# EAGLE design CAN-Simulator_v2 (EAGLE 7.5.0)
DATABASE: /home/monkbroc/Electronics/eagle/PARTSDB.tsv
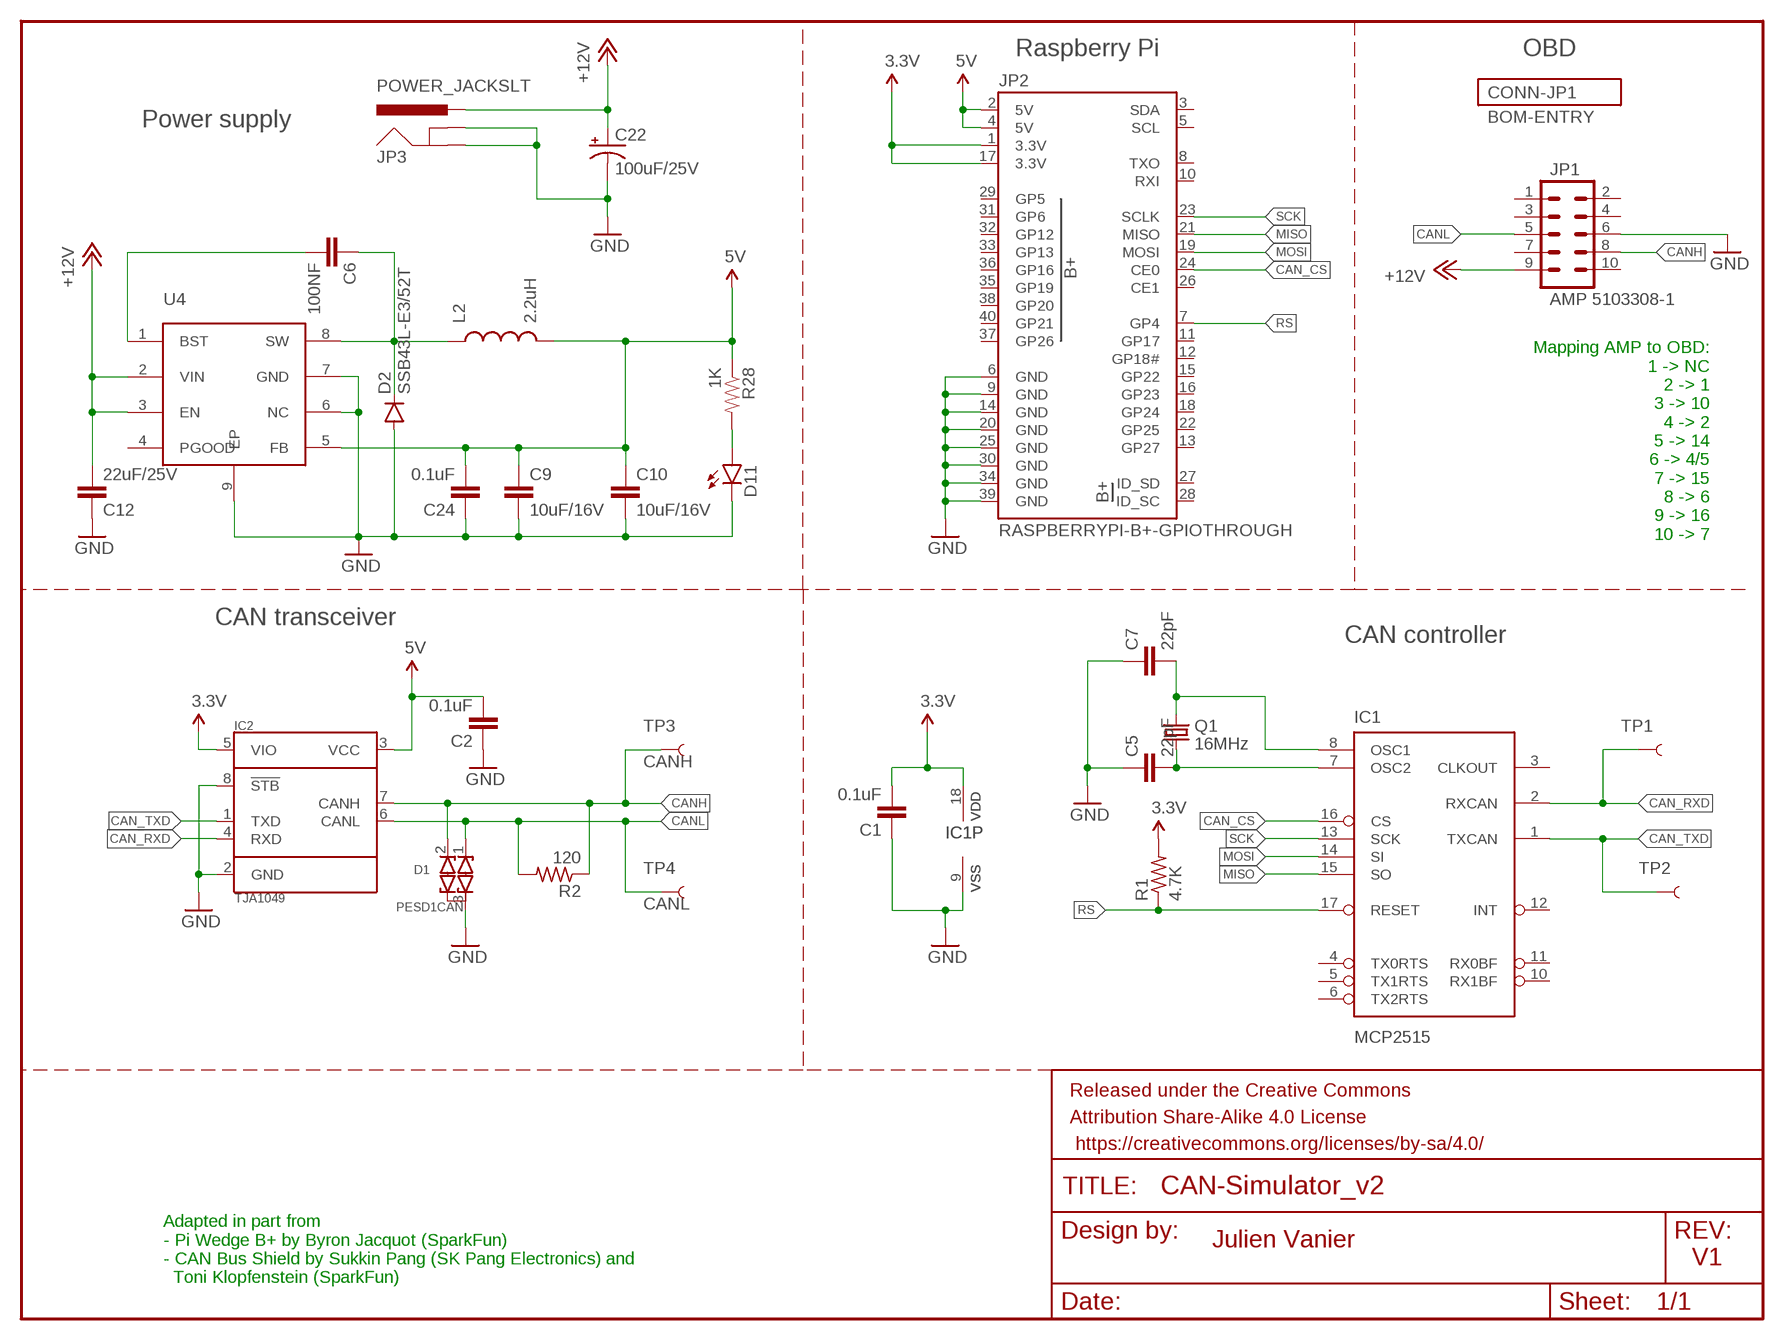
[diagram p0: schematic, sheet 1]
CONN-JP1 (BOM-ENTRY): PARTNO: 1658621-1

## Parts
C1  0.1uF  CAP0402-CAP  [0402-CAP]
C2  0.1uF  CAP0402-CAP  [0402-CAP]
C5  22pF  C-EUC0805  [C0805]
C6  100NF  CAP0402-CAP  [0402-CAP]
C7  22pF  C-EUC0805  [C0805]
C9  10uF/16V  10UF10V10%(0805)  [0805-CAP]
C10  10uF/16V  10UF10V10%(0805)  [0805-CAP]
C12  22uF/25V  22UF-16V-20%-(1210)  [1210]
C22  100uF/25V  100UF-25V-20%(PTH)  [CPOL-RADIAL-100UF-25V]
C24  0.1uF  CAP0402-CAP  [0402-CAP]
D1  PESD1CAN  DIODE_ESD_DUAL-SOT-23  [SOT23]
D2  SSB43L-E3/52T  DIODESMB  [SMB-DIODE]
D11  LED0603  [LED-0603]
FRAME1  FRAME-LETTER  [CREATIVE_COMMONS]
IC1  MCP2515  MCP2510SO  [SO-18W]
IC2  TJA1049  [SO8]
JP1  AMP 5103308-1  M05X2SHD  [2X5-SHROUDED]
JP2  RASPBERRYPI-B+-GPIOTHROUGH  [PIN_20X2]
JP3  POWER_JACKSLT  [POWER_JACK_SLOT]
L2  2.2uH  INDUCTOR4818  [I4818]
Q1  16MHz  CRYSTAL5X3  [CRYSTAL-SMD-5X3]
R1  4.7K  R-US_R0402  [R0402]
R2  120  R-US_R0603  [R0603]
R28  1K  RESISTOR0402-RES  [0402-RES]
TP1  TEST-POINT3X5  [PAD.03X.05]
TP2  TEST-POINT3X5  [PAD.03X.05]
TP3  CANH  TEST-POINT3  [PAD.03X.03]
TP4  CANL  TEST-POINT3  [PAD.03X.03]
U4  ADP2303  [ADP2302]

## Nets
3.3V: C1.2 IC1.18(VDD) IC2.5(VIO) JP2.1(3.3V) JP2.17(3.3V) R1.2
5V [power]: C2.2 C9.1 C10.1 C24.2 IC2.3(VCC) JP2.2(5V) JP2.4(5V) L2.2 R28.1 U4.5(FB)
+12V [power]: C12.2 C22.1(+) JP1.9 JP3.PWR U4.2(VIN) U4.3(EN)
CAN_CS: IC1.16(CS) JP2.24(CE0)
CAN_RXD: IC1.2(RXCAN) IC2.4(RXD) TP1.P$1
CAN_TXD: IC1.1(TXCAN) IC2.1(TXD) TP2.P$1
CANH: D1.2(C2) IC2.7(CANH) JP1.8 R2.1 TP3.P$1
CANL: D1.1(C1) IC2.6(CANL) JP1.5 R2.2 TP4.P$1
GND [power]: C1.1 C2.1 C5.1 C7.1 C9.2 C10.2 C12.1 C22.2(-) C24.1 D1.3(COM) D2.A D11.C IC1.9(VSS) IC2.2(GND) IC2.8(!STB) JP1.6 JP2.6(GND) JP2.9(GND) JP2.14(GND) JP2.20(GND) JP2.25(GND) JP2.30(GND) JP2.34(GND) JP2.39(GND) JP3.GND@1(GNDBREAK) JP3.GND@2(GND) U4.6(NC) U4.7(GND) U4.9(EP)
MISO: IC1.15(SO) JP2.21(MISO)
MOSI: IC1.14(SI) JP2.19(MOSI)
N$17: C7.2 IC1.8(OSC1) Q1.3
N$18: C5.2 IC1.7(OSC2) Q1.1
N$21: C6.2 U4.1(BST)
N$25: C6.1 D2.C L2.1 U4.8(SW)
N$46: D11.A R28.2
RS: IC1.17(RESET) JP2.7(GP4) R1.1
SCK: IC1.13(SCK) JP2.23(SCLK)
Unconnected: IC1.3(CLKOUT) IC1.4(TX0RTS) IC1.5(TX1RTS) IC1.6(TX2RTS) IC1.10(RX1BF) IC1.11(RX0BF) IC1.12(INT) JP1.1 JP1.2 JP1.3 JP1.4 JP1.7 JP1.10 JP2.3(SDA) JP2.5(SCL) JP2.8(TXO) JP2.10(RXI) JP2.11(GP17) JP2.12(GP18#) JP2.13(GP27) JP2.15(GP22) JP2.16(GP23) JP2.18(GP24) JP2.22(GP25) JP2.26(CE1) JP2.27(ID_SD) JP2.28(ID_SC) JP2.29(GP5) JP2.31(GP6) JP2.32(GP12) JP2.33(GP13) JP2.35(GP19) JP2.36(GP16) JP2.37(GP26) JP2.38(GP20) JP2.40(GP21) U4.4(PGOOD)

## Notes on the sheet
- Raspberry Pi | OBD
- Power supply
- Mapping AMP to OBD:
  1 -> NC
  2 -> 1
  3 -> 10
  4 -> 2
  5 -> 14
  6 -> 4/5
  7 -> 15
  8 -> 6
  9 -> 16
  10 -> 7
- CAN transceiver
- CAN controller
- Julien Vanier
- V1
- Adapted in part from
  - Pi Wedge B+ by Byron Jacquot (SparkFun)
  - CAN Bus Shield by Sukkin Pang (SK Pang Electronics) and
    Toni Klopfenstein (SparkFun)

## Library data of the parts
C1 C2 C6 C24 = SparkFun-Passives:CAP: Capacitor Standard 0603 ceramic capacitor, and 0.1" leaded capacitor.
C5 C7 = rcl:C-EU: CAPACITOR, European symbol; PARTNO: C0805C220J5GACTU
C9 C10 = SparkFun-Capacitors:10UF10V10%(0805): CAP-11330; PROD_ID: CAP-11330
C12 = SparkFun-Capacitors:22UF-16V-20%-(1210): CAP-10381; PROD_ID: CAP-10381; VALUE: 22uF
C22 = SparkFun-Capacitors:100UF-25V-20%(PTH): CAP-08439; PROD_ID: CAP-08439
D1 = MuniRent:DIODE_ESD_DUAL: Dual ESD Diode, with a common anode; PARTNO: PESD1CAN-215
D2 = SparkFun-DiscreteSemi:DIODE: Diode These are standard reverse protection diodes and small signal diodes. SMA package can handle up to about 1A. SOD-323 can handle about 200mA. What the SOD-323 package when ordering, there are some mfgs out there that are 5-pin packages.; PROD_ID: DIO-09646
D11 = SparkFun-LED:LED: LEDs Standard schematic elements and footprints for 5mm, 3mm, 1206, and 0603 sized LEDs. 5mm - Spark Fun Electronics SKU : COM-00529 (and others)
FRAME1 = SparkFun-Aesthetics:FRAME-LETTER: Schematic Frame Standard 8.5x11 US Letter frame; BOM: EXCLUDE
IC1 = SparkFun-DigitalIC:MCP2510: CAN controller with SPI interface to any MCU. Original design by Microchip.; PARTNO: MCP2515-I/SO; PROD_ID: IC-09906
IC2 = MuniRent:TJA1049; PARTNO: TJA1049T-118
JP1 = SparkFun-Connectors:M05X2: Header 5x2 Standard 10-pin dual row 0.1" header. Commonly used with AVR-ISP. Use with Spark Fun Electronics SKU: PRT-00778; PARTNO: 5103308-1
JP2 = MuniRent:RASPBERRYPI-B+-GPIO: Raspberry Pi B+ GPIO Header 2x20 pin connector
JP3 = MuniRent:POWER_JACK: Power Jack This is the standard 5.5mm barrel jack for power. The PTH is the most common, proven, reliable, footprint. The Slot footprint only works if the mill layer is transmitted to the PCB fab house so be warned. Spark Fun Electronics SKU : PRT-00119 SMT: CONN-08106 Mating wall wart : TOL-00298 (and others)
L2 = MuniRent:INDUCTOR: Inductors Basic Inductor/Choke - 0603 and 1206. Footprints are not proven and vary greatly between part numbers.
Q1 = SparkFun-FreqCtrl:CRYSTAL: Various standard crystals. Proven footprints.; PARTNO: ABM3B-16.000MHZ-10-1-U-T; PROD_ID: XTAL-08218
R1 = rcl:R-US_: RESISTOR, American symbol; PARTNO: RC0805JR-0747KL
R2 = rcl:R-US_: RESISTOR, American symbol; PARTNO: RC0603FR-07120RL
R28 = SparkFun-Passives:RESISTOR: Resistor Basic schematic elements and footprints for 0603, 1206, and PTH resistors.
TP1-TP4 = SparkFun-Passives:TEST-POINT: Bare copper test points for troubleshooting or ICT; BOM: EXCLUDE
U4 = MuniRent:ADP2303

## Net classes
1 power: width 0.813 mm, clearance 0.406 mm

## Board
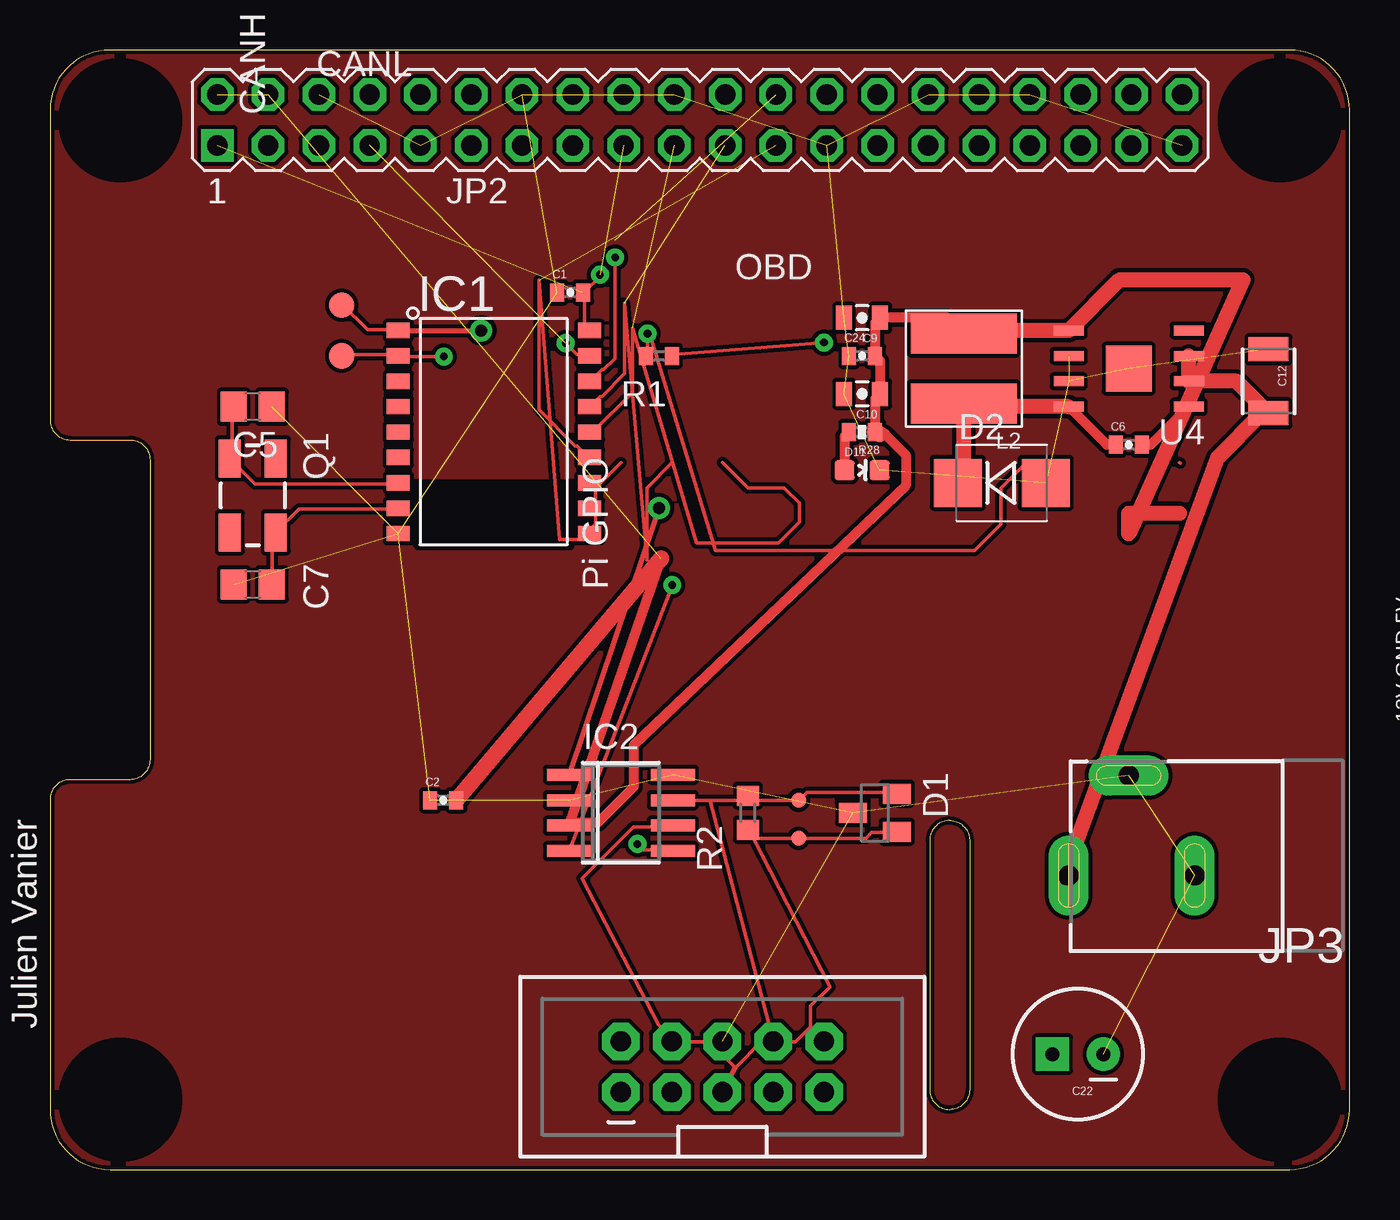
[diagram p1: board, top side]
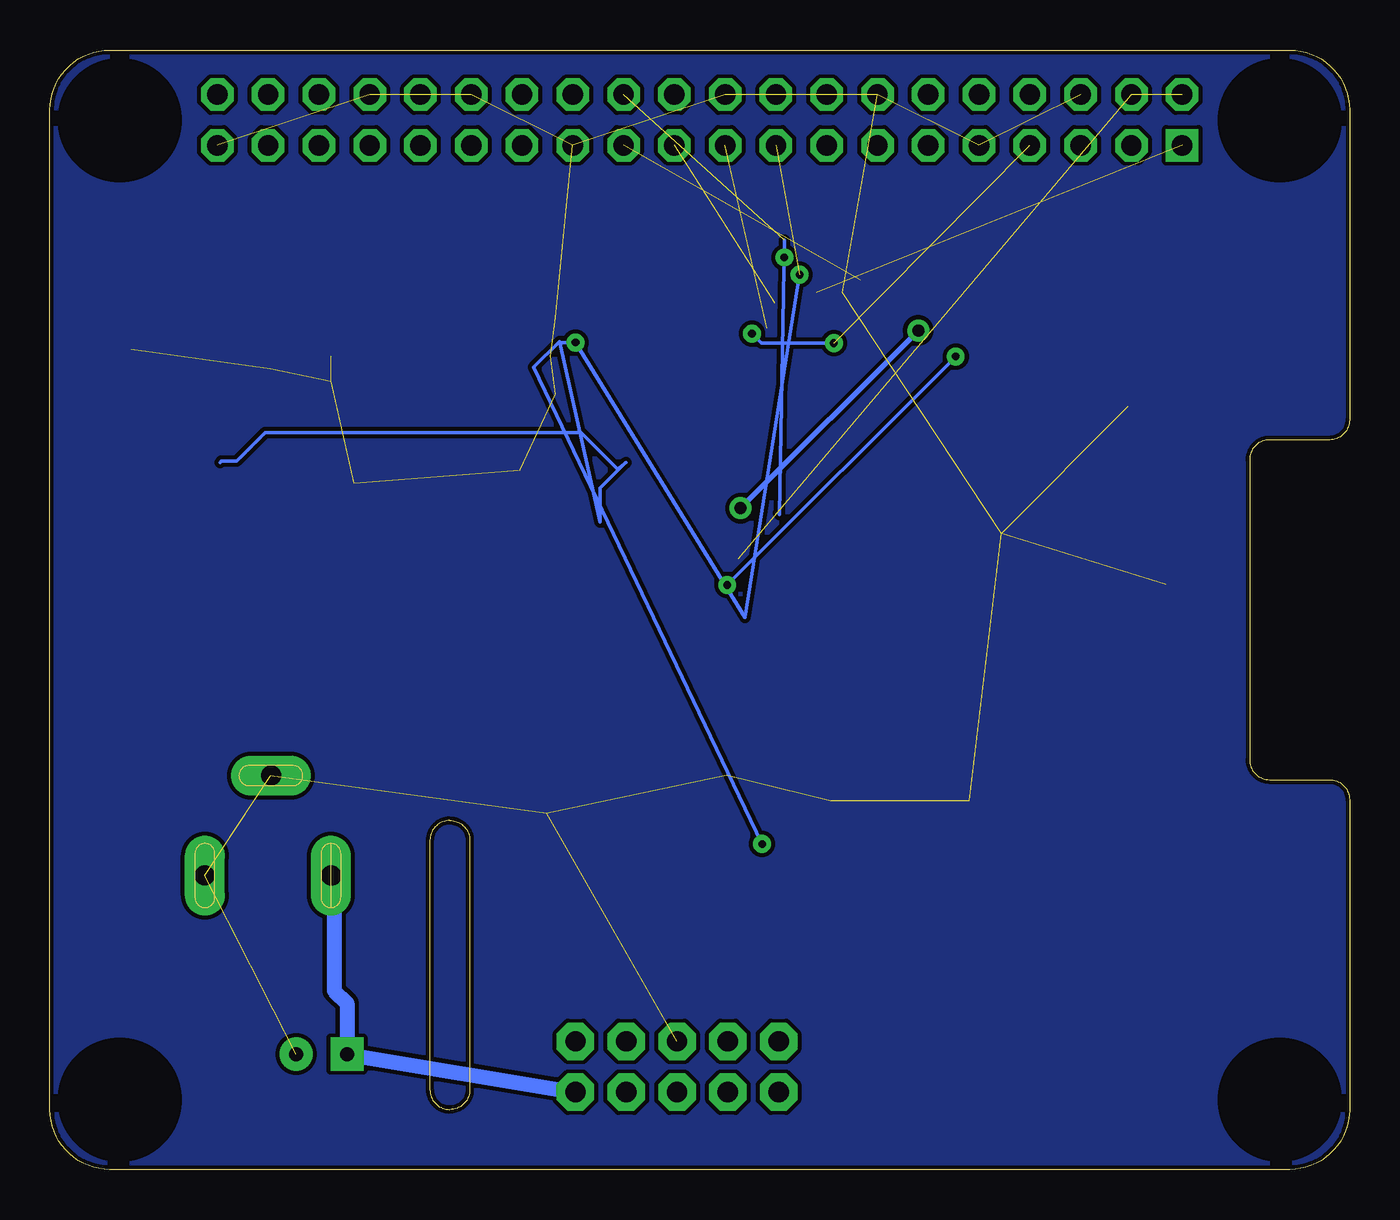
[diagram p2: board, bottom side, seen from below]

Size 65 x 56 mm. Coordinates in mm from the lower left corner, seen from the top.
Outline: 0,3 arc90 3,0 62,0 arc90 65,3 65,53 arc90 62,56 3,56 arc90 0,53 0,37.5 arc90 1,36.5 4,36.5 arc-90 5,35.5 5,20.5 arc-90 4,19.5 1,19.5 arc90 0,18.5 0,3
Outline: 44,16.46 44,4 arc90 45,3 arc90 46,4 46,16.46 arc90 45,17.46 arc90 44,16.46
Copper layers (1*16): Top 0.035mm / dielectric 1.5mm / Bottom 0.035mm
Design rules "SparkFun-2-layer *": minimum track width 7mil, minimum drill 15mil, track to track 8mil, track to pad 8mil, pad to pad 8mil, via to via 8mil, smd to smd 8mil, copper to edge 8mil, drill to drill 8mil, minimum pad ring 12mil, minimum via ring 10mil, stop-mask expansion 4mil, vias tented up to drill 20mil, thermal gap 10mil
tRestrict: area 18.4,31.2 to 26,34.4; area 1.9,51 to 5.1,54; area 60,51 to 63,54; area 60,1.9 to 63,5; area 1.9,1.9 to 5.1,5
bRestrict: area 1.9,1.9 to 5.1,5; area 1.9,51 to 5.1,54; area 60,1.9 to 63,5; area 60,51 to 63,54

### Footprints (pad centres in the part's own frame; a part is rotated, then mirrored left to right if it is on the bottom)
0402-CAP = smd 0.7 x 0.9: 1 -0.65,0; 2 0.65,0
C0805 = smd 1.3 x 1.5: 1 -0.95,0; 2 0.95,0
0805-CAP = smd 0.8 x 1.2: 1 -0.9,0; 2 0.9,0
1210 = smd 1.2 x 2: 1 -1.6,0; 2 1.6,0
CPOL-RADIAL-100UF-25V = drill 0.7 pad 1.651 square: 1 1.27,0 | drill 0.7 pad 1.651: 2 -1.27,0
SOT23 = smd 1 x 1.4: 1 -0.95,-1.1; 2 0.95,-1.1; 3 0,1.1
SMB-DIODE = smd 2.4 x 2.4: A 2.2,0; C -2.2,0
LED-0603 = smd 1 x 1: A 0,-0.877; C 0,0.877
SO-18W = smd 0.762 x 1.143: 1 -5.08,-4.788; 2 -3.81,-4.788; 3 -2.54,-4.788; 4 -1.27,-4.788; 5 0,-4.788; 6 1.27,-4.788; 7 2.54,-4.788; 8 3.81,-4.788; 9 5.08,-4.788; 10 5.08,4.788; 11 3.81,4.788; 12 2.54,4.788; 13 1.27,4.788; 14 0,4.788; 15 -1.27,4.788; 16 -2.54,4.788; 17 -3.81,4.788; 18 -5.08,4.788
SO8 = smd 0.6 x 2.2: 1 -1.905,-2.6; 2 -0.635,-2.6; 3 0.635,-2.6; 4 1.905,-2.6; 5 1.905,2.6; 6 0.635,2.6; 7 -0.635,2.6; 8 -1.905,2.6
2X5-SHROUDED = drill 1.016 pad 1.88 octagon: 1 -1.27,5.08; 2 1.27,5.08; 3 -1.27,2.54; 4 1.27,2.54; 5 -1.27,0; 6 1.27,0; 7 -1.27,-2.54; 8 1.27,-2.54; 9 -1.27,-5.08; 10 1.27,-5.08
PIN_20X2 = drill 1.016 square: 1 -24.13,-1.27 | drill 1.016 octagon: 2 -24.13,1.27; 3 -21.59,-1.27; 4 -21.59,1.27; 5 -19.05,-1.27; 6 -19.05,1.27; 7 -16.51,-1.27; 8 -16.51,1.27; 9 -13.97,-1.27; 10 -13.97,1.27; 11 -11.43,-1.27; 12 -11.43,1.27; 13 -8.89,-1.27; 14 -8.89,1.27; 15 -6.35,-1.27; 16 -6.35,1.27; 17 -3.81,-1.27; 18 -3.81,1.27; 19 -1.27,-1.27; 20 -1.27,1.27; 21 1.27,-1.27; 22 1.27,1.27; 23 3.81,-1.27; 24 3.81,1.27; 25 6.35,-1.27; 26 6.35,1.27; 27 8.89,-1.27; 28 8.89,1.27; 29 11.43,-1.27; 30 11.43,1.27; 31 13.97,-1.27; 32 13.97,1.27; 33 16.51,-1.27; 34 16.51,1.27; 35 19.05,-1.27; 36 19.05,1.27; 37 21.59,-1.27; 38 21.59,1.27; 39 24.13,-1.27; 40 24.13,1.27
POWER_JACK_SLOT = drill 1 pad 2 long: GND@1 2.58,7.5; GND@2 7.58,10.8; PWR 2.58,13.8
I4818 = smd 5.3 x 2: 1 0,1.75; 2 0,-1.75
CRYSTAL-SMD-5X3 = smd 1.9 x 1.1: 1 -1.85,-1.15; 2 1.85,-1.15; 3 1.85,1.15; 4 -1.85,1.15
R0402 = smd 0.7 x 0.9: 1 -0.65,0; 2 0.65,0
R0603 = smd 1 x 1.1: 1 -0.85,0; 2 0.85,0
0402-RES = smd 0.7 x 0.9: 1 -0.65,0; 2 0.65,0
PAD.03X.05 = smd 1.27 x 1.27: P$1 0,0
PAD.03X.03 = smd 0.762 x 0.762: P$1 0,0
ADP2302 = smd 1.5 x 0.5: 1 -3,1.905; 2 -3,0.635; 3 -3,-0.635; 4 -3,-1.905; 5 3,-1.905; 6 3,-0.635; 7 3,0.636; 8 3,1.905 | smd 2.29 x 2.29: 9 0,0

### Placement (x,y rotation side)
C1  26.02,43.88 0 top
C2  19.66,18.48 0 top
C5  10.14,38.16 180 top
C6  53.96,36.25 0 top
C7  10.14,29.27 0 top
C9  40.62,42.6 180 top
C10  40.62,38.8 180 top
C12  60.94,39.43 270 top
C22  51.42,5.78 180 top
C24  40.62,40.7 0 top
D1  41.26,17.84 90 top
D2  47.61,34.35 0 top
D11  40.62,34.98 270 top
FRAME1  11.41,-15.18 0 top  (outside the outline)
IC1  22.2,36.89 270 top
IC2  28.55,17.84 270 top
JP1  33.63,5.14 90 top
JP2  32.5,52.5 0 top
JP3  64.75,12.12 90 top
L2  45.7,40.06 180 top
Q1  10.14,33.71 270 top
R1  30.46,40.7 0 top
R2  34.91,17.84 270 top
R28  40.62,36.89 180 top
TP1  14.58,40.7 0 top
TP2  14.58,43.24 0 top
TP3  37.45,18.48 0 top
TP4  37.45,16.57 0 top
U4  53.96,40.06 180 top

### Tracks (layer width: path | path; a pad name or v marks a point on that pad's centre or on a via)
3.3V  (via drill 0.38)  (3 unrouted)
  Top 0.178: 56.53,35.33 56.5,35.37 | IC1.18 26.94,42 26.75,42.19 26.75,43.81 C1.2 26.75,43.91 27.51,44.67 v27.51,44.76 | v38.72,41.37 31.13,40.76 R1.2 | v29.38,16.28 29.67,16 31.09,16 IC2.5
  Bottom 0.178: 39.53,41.41 37.48,32.38 37.48,34.1 36.24,35.33 36.18,35.37 36.62,35.05 38.43,36.86 54.24,36.86 55.67,35.43 56.43,35.43 56.5,35.37 | 39.53,41.41 39.48,41.37 v38.72,41.37 30.24,27.62 v27.51,44.76 | v29.38,16.28 40.81,40.13 39.53,41.41
5V  (2 unrouted)
  Top 0.508: L2.2 44.91,42.6 C9.1 41.27,42.35 C24.2 41.52,40.45 C10.1 41.27,38.55 R28.1 | 30.55,30.57 25.95,17.24 IC2.3 26.33,17.33 27.38,17.33 29.19,19.14 29.19,21.24 42.81,34.22 42.81,35.75 41.76,36.8 41.48,36.8
  Top 0.762: L2.2 46.82,41.81 46.97,41.97 U4.5 53.5,44.51 59.67,44.51 53.96,31.81 53.96,32.83 56.5,32.83
  Top 0.813: 30.55,30.57 C2.2 | 41.48,36.8 R28.1
+12V  (via drill 0.6)
  Top 0.762: U4.3 U4.2 59.34,39.43 C12.2 60.61,37.83 58.4,35.62 50.78,14.88 JP3.PWR v50.78,14.54
  Bottom 0.762: v50.78,14.54 50.78,8.95 50.15,8.32 C22.1 JP1.9
CAN_CS  (via drill 0.38)  (1 unrouted)
  Top 0.178: v28.27,45.62 28.27,40.57 27.7,40 27.6,40 27.03,39.43 IC1.16
  Bottom 0.178: v28.27,45.62 28.27,46.48 28.52,32.76 28.55,32.83
CAN_RXD  (via drill 0.38)
  Top 0.178: TP1.P$1 14.65,40.76 17.41,40.76 IC1.2 17.51,40.67 v19.7,40.67 | v31.13,29.24 25.95,15.9 IC2.4
  Bottom 0.178: v31.13,29.24 v19.7,40.67
CAN_TXD  (via drill 0.6)
  Top 0.178: IC1.1 17.41,42 15.89,42 14.65,43.24 TP2.P$1 14.55,43.24 | 25.95,19.71 IC2.1
  Top 0.254: IC1.1 v21.57,41.97 | v30.46,33.08 IC2.1
  Bottom 0.254: v21.57,41.97 v30.46,33.08
CANH
  Top 0.178: D1.2 42.34,18.86 37.86,18.86 37.48,18.48 TP3.P$1 35.1,18.48 34.91,18.66 R2.1 35,18.48 33,18.48 | 33,18.48 IC2.7 | 33,18.48 JP1.8
CANL
  Top 0.178: D1.1 42.34,16.86 41.1,16.86 40.81,16.57 TP4.P$1 35.29,16.57 34.91,16.95 R2.2 35.19,16.57 39,9.14 38.05,8.19 38.05,7.14 37.29,6.38 35.57,6.38 34.33,5.14 JP1.5 34.24,5.14 33,6.38 31.29,6.38 30.43,7.24 26.62,14.57 29.19,17.14 31.09,17.14 IC2.6
GND  (28 unrouted)
GND1
  pour Bottom: 0,3 arc90 3,0 62,0 arc90 65,3 65,53 arc90 62,56 3,56 arc90 0,53 0,37.5 arc90 1,36.5 4,36.5 arc-90 5,35.5 5,20.5 arc-90 4,19.5 1,19.5 arc90 0,18.5
  pour Top: 0,3 arc90 3,0 62,0 arc90 65,3 65,53 arc90 62,56 3,56 arc90 0,53 0,37.5 arc90 1,36.5 4,36.5 arc-90 5,35.5 5,20.5 arc-90 4,19.5 1,19.5 arc90 0,18.5
MISO  (1 unrouted)
  Top 0.178: IC1.15 27.03,38.19 27.51,38.67 27.6,38.67 28.75,39.81 28.75,43.34 29.86,30.48 29.86,34.1 31.09,35.33 31.09,35.37
MOSI  (1 unrouted)
  Top 0.178: 33.63,35.37 34.91,34.1 36.72,34.1 37.48,33.33 37.48,32.38 36.43,31.33 32.33,31.33 29.13,42.1 29.13,38.86 27.22,36.95 27.03,36.95 IC1.14
N$17
  Top 0.178: IC1.8 17.41,33.05 12.46,33.05 11.31,31.91 Q1.3 11.22,31.81 11.12,31.72 11.12,29.33 C7.2
N$18
  Top 0.178: IC1.7 17.41,34.29 10.27,34.29 9.03,35.52 Q1.1 9.12,35.52 9.12,38.1 C5.2
N$21
  Top 0.508: C6.2 55.05,36.25 U4.1
N$25
  Top 0.508: C6.1 52.86,36.25 U4.8
  Top 0.762: U4.8 46.97,38.16 46.82,38.31 L2.1 45.7,34.64 D2.C
N$46
  Top 0.508: R28.2 39.74,36.66 D11.A
RS  (via drill 0.38)  (1 unrouted)
  Top 0.178: 30.03,41.67 33.29,30.95 46.24,30.95 47.57,32.29 47.57,34.1 48.81,35.33 48.88,35.37 | 30.03,41.67 29.89,41.53 29.89,40.76 R1.1 | v25.79,41.34 26.36,40.76 26.94,40.76 IC1.17 | 30.03,41.67 v29.89,41.81
  Bottom 0.178: v25.79,41.34 29.41,41.34 v29.89,41.81
SCK  (1 unrouted)
  Top 0.178: 28.55,35.37 27.29,34.1 27.29,32.29 26.52,31.52 25.47,31.52 24.46,44.48 24.46,38 26.27,36.19 26.36,36.19 26.94,35.62 IC1.13

### Text on the board
Top: V2
tPlace: CANL | CANH | OBD | Pi GPIO | 12V GND 5V | Raspberry Pi / CAN Simulator / Julien Vanier